# EAGLE design oledm204 (EAGLE 9.6.2)
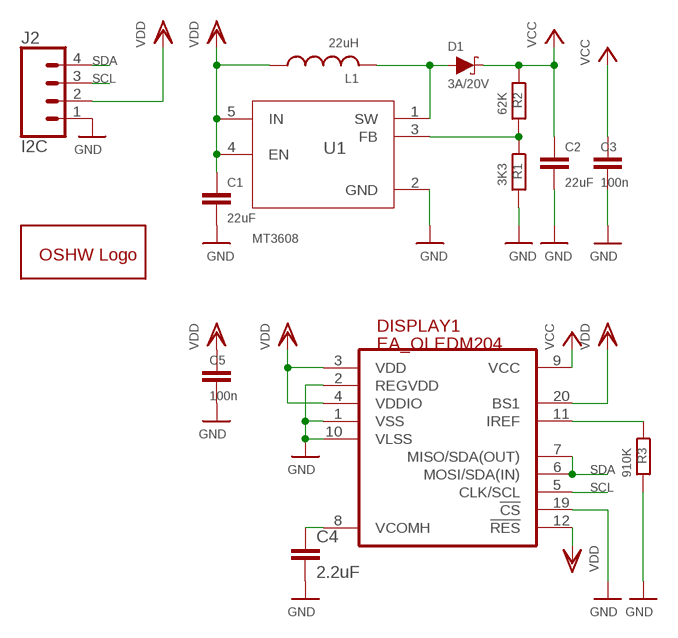
[diagram p0: schematic, sheet 1]

## Parts
C1  22uF  C-EUC0603  [C0603]
C2  22uF  C-EUC0603  [C0603]
C3  100n  C-EUC0603  [C0603]
C4  2.2uF  C-EUC0603  [C0603]
C5  100n  C-EUC0603  [C0603]
D1  3A/20V  DIODE-SCHOTTKY-SS14  [SMA-DIODE]
DISPLAY1  EA_OLEDM204  [EA_OLEDM204]
GOLD_ORB_SM1  OSHWLOGOLOGO5MM  [OSHW_5MM]
J2  I2C  CONN_04  [1X04]
L1  22uH  L-USPIS2816  [PIS2816]
R1  3K3  R-EU_R0402  [R0402]
R2  62K  R-EU_R0402  [R0402]
R3  910K  R-EU_R0402  [R0402]
U1  MT3608  [SOT95P280X145-6N]

## Nets
GND: C1.2 C2.2 C3.2 C4.2 C5.2 DISPLAY1.1(VSS) DISPLAY1.2(REGVDD) DISPLAY1.10(VLSS) DISPLAY1.19(!CS!) J2.1 R1.2 R3.2 U1.2(GND)
N$1: DISPLAY1.11(IREF) R3.1
N$3: R1.1 R2.2 U1.3(FB)
N$4: D1.A L1.2 U1.1(SW)
N$5: C4.1 DISPLAY1.8(VCOMH)
SCL: DISPLAY1.5(CLK/SCL) J2.3
SDA: DISPLAY1.6(MOSI/SDA(IN)) DISPLAY1.7(MISO/SDA(OUT)) J2.4
VCC: C2.1 C3.1 D1.C DISPLAY1.9(VCC) R2.1
VDD: C1.1 C5.1 DISPLAY1.3(VDD) DISPLAY1.4(VDDIO) DISPLAY1.12(!RES!) DISPLAY1.20(BS1) J2.2 L1.1 U1.4(EN) U1.5(IN)

## Library data of the parts
C1-C5 = rcl:C-EU: CAPACITOR, European symbol; SPICEPREFIX: C
D1 = SparkFun-DiscreteSemi:DIODE-SCHOTTKY: Schottky diode A Schottky diode is a semiconductor diode which has a low forward voltage drop and a very fast switching action.; PROD_ID: DIO-08053; VALUE: 1A/40V/500mV
DISPLAY1 = ea_v65:EA_OLEDM204: ELECTRONIC ASSEMBLY EA OLEDM204-LGA EA OLEDM204-LWA EA OLEDM204-GGA
GOLD_ORB_SM1 = oshw:OSHWLOGO: The OSHW logo for PCB layout
J2 = SparkFun-Connectors:CONN_04: Multi connection point. Often used as Generic Header-pin footprint for 0.1 inch spaced/style header connections On any of the 0.1 inch spaced packages, you can populate with these: Break Away Headers - Straight <https://www.sparkfun.com/products/116> (PRT-00116) Break Away Male Headers - Right Angle <https://www.sparkfun.com/products/553> (PRT-00553) Female Headers <https://www.sparkfun.com/products/115> (PRT-00115) Break Away Headers - Machine Pin <https://www.sparkfun.com/products/117> (PRT-00117) Break Away Female Headers - Swiss Machine Pin <https://www.sparkfun.com/products/743> (PRT-00743) For SCREWTERMINALS and SPRING TERMINALS visit here: Screw Terimnals on SparkFun.com <https://www.sparkfun.com/search/results?term=Screw+Terminals> (5mm/3.5mm/2.54mm spacing) This device is also useful as a general connection point to wire up your design to another part of your project. Our various solder wires solder well into these plated through hole pads. Hook-Up Wire - Assortment (Stranded, 22 AWG) <https://www.sparkfun.com/products/11375> (PRT-11375) Hook-Up Wire - Assortment (Solid Core, 22 AWG) <https://www.sparkfun.com/products/11367> (PRT-11367) View the entire wire category on our website here <https://www.sparkfun.com/categories/141> Special notes: Molex polarized connector foot print use with SKU : PRT-08231 with associated crimp pins and housings. 1MM SMD Version SKU: PRT-10208; PROD_ID: CONN-09696
L1 = rcl:L-US: INDUCTOR, American symbol; SPICEPREFIX: L
R1-R3 = resistor:R-EU_: RESISTOR, European symbol
U1 = MT3608:MT3608: High Efficiency 1.2MHz 2A Step Up Converter; AVAILABILITY: Unavailable; DESCRIPTION: High Efficiency 1.2MHz 2A Step Up Converter; MF: Aerosemi Technology Co., Ltd; MP: MT3608; PACKAGE: Package; PRICE: None

## Board
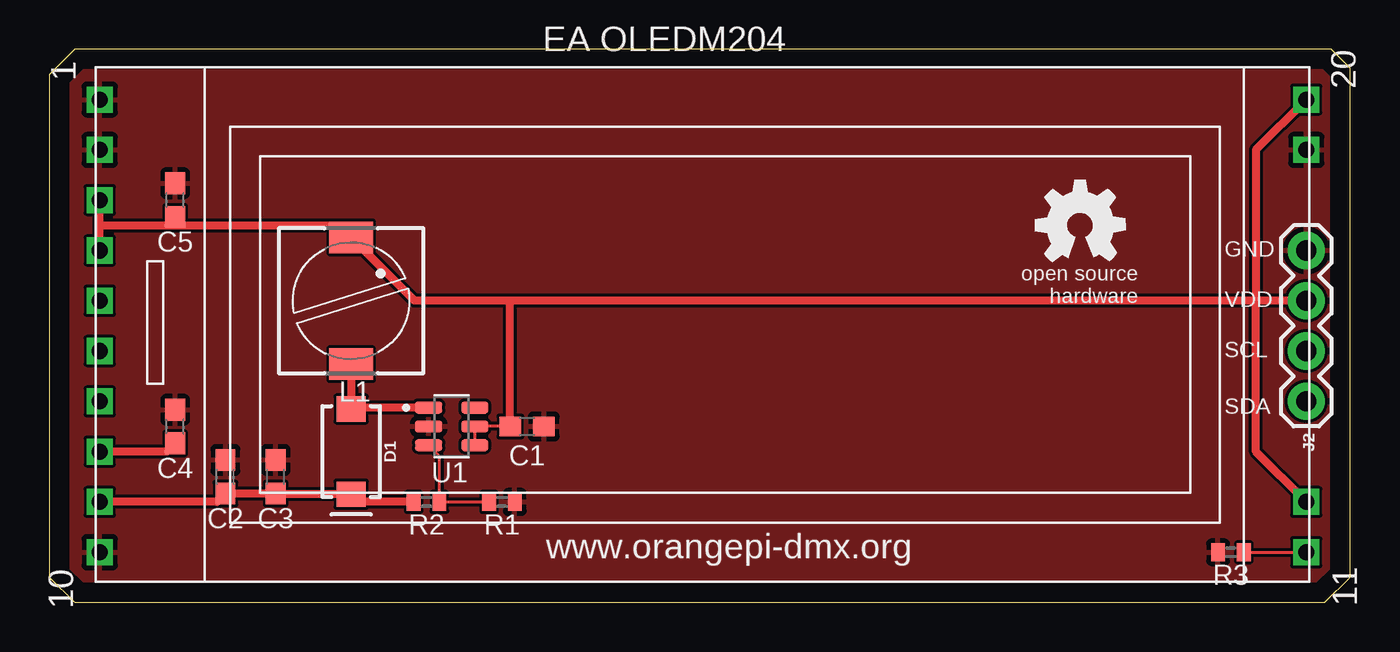
[diagram p1: board, top side]
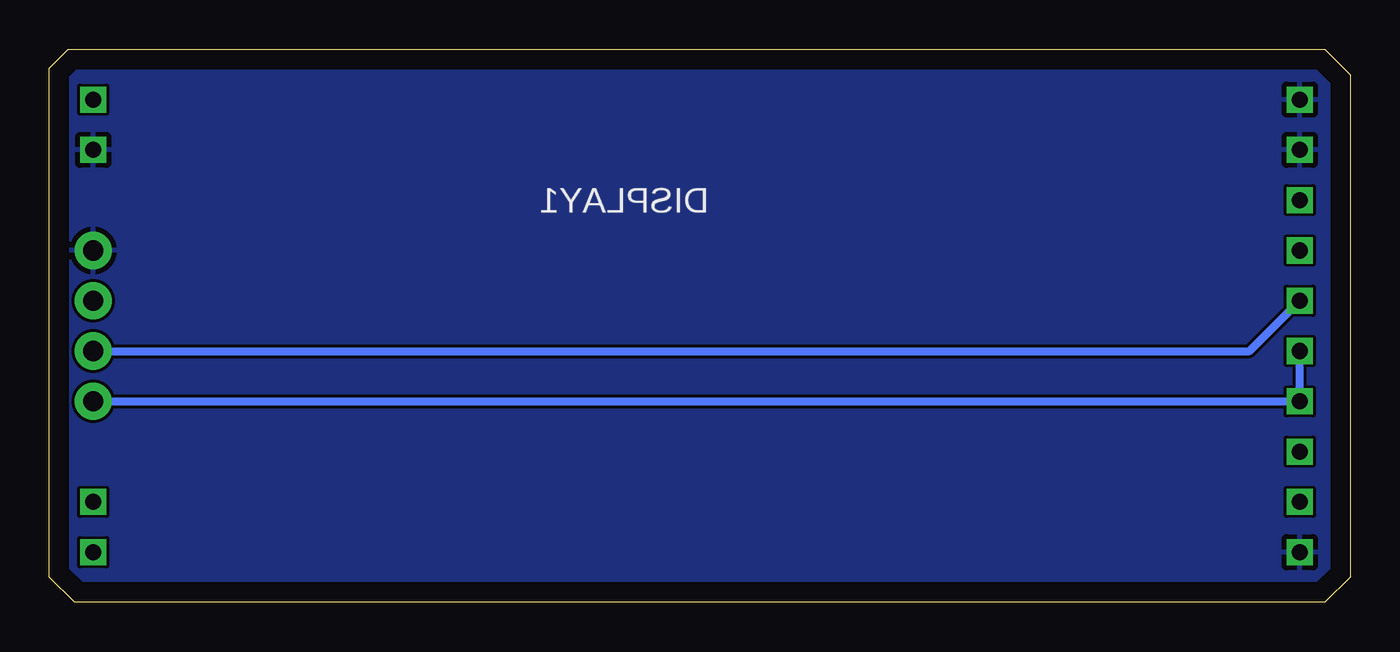
[diagram p2: board, bottom side, seen from below]

Size 65.71 x 27.93 mm. Coordinates in mm from the lower left corner, seen from the top.
Outline: 0,26.66 0,1.27 1.27,0 64.44,0 65.71,1.27 65.71,26.99 64.77,27.93 1.27,27.93 0,26.66
Copper layers (1*16): Top 0.035mm / dielectric 1.5mm / Bottom 0.035mm
Design rules "default": minimum track width 6mil, minimum drill 0.35mm, track to track 6mil, track to pad 6mil, pad to pad 6mil, via to via 6mil, smd to smd 6mil, copper to edge 40mil, drill to drill 6mil, minimum pad ring 10mil, minimum via ring 8mil, stop-mask expansion 4mil, vias tented up to drill 0mil, thermal gap 10mil

### Footprints (pad centres in the part's own frame; a part is rotated, then mirrored left to right if it is on the bottom)
C0603 = smd 1.1 x 1: 1 -0.85,0; 2 0.85,0
SMA-DIODE = smd 1.27 x 1.47: A -2.15,0; C 2.15,0
EA_OLEDM204 = drill 0.813 square: 1 0,22.86; 2 0,20.32; 3 0,17.78; 4 0,15.24; 5 0,12.7; 6 0,10.16; 7 0,7.62; 8 0,5.08; 9 0,2.54; 10 0,0; 11 60.96,0; 12 60.96,2.54; 19 60.96,20.32; 20 60.96,22.86
1X04 = drill 1.016 pad 1.88: 1 0,0; 2 2.54,0; 3 5.08,0; 4 7.62,0
PIS2816 = smd 2.2 x 1.6: 1 0,3.2; 2 0,-3.2
R0402 = smd 0.7 x 0.9: 1 -0.65,0; 2 0.65,0
SOT95P280X145-6N = smd 1.37 x 0.59: 1 -1.17,0.95; 2 -1.17,0; 3 -1.17,-0.95; 4 1.17,-0.95; 5 1.17,0; 6 1.17,0.95

### Placement (x,y rotation side)
C1  24.13,8.89 0 top
C2  8.89,6.35 90 top
C3  11.43,6.35 90 top
C4  6.35,8.89 90 top
C5  6.35,20.32 90 top
D1  15.24,7.62 270 top
DISPLAY1  2.54,2.54 0 top
GOLD_ORB_SM1  52.07,19.05 0 top
J2  63.5,17.78 270 top
L1  15.24,15.24 0 top
R1  22.86,5.08 0 top
R2  19.05,5.08 0 top
R3  59.69,2.54 180 top
U1  20.32,8.89 0 top

### Tracks (layer width: path | path; a pad name or v marks a point on that pad's centre or on a via)
GND
  pour Top: -1.27,-1.27 67.31,-1.27 67.31,29.21 -1.27,29.21
  pour Bottom: -1.27,-1.27 67.31,-1.27 67.31,29.21 -1.27,29.21
N$1
  Top 0.152: R3.1 DISPLAY1.11
N$3
  Top 0.152: R1.1 R2.2 19.7,7.39 U1.3
N$4
  Top 0.152: 15.31,9.84 D1.A
  Top 0.406: U1.1 15.31,9.84 | L1.2 D1.A
N$5
  Top 0.406: C4.1 5.93,7.62 DISPLAY1.8
SCL
  Bottom 0.406: J2.3 5.08,12.7 DISPLAY1.5
SDA
  Bottom 0.406: J2.4 DISPLAY1.7 DISPLAY1.6
VCC
  Top 0.152: 15.44,5.27 D1.C
  Top 0.406: R2.1 15.63,5.08 15.44,5.27 | D1.C 11.46,5.47 C3.1 C2.1 8.47,5.08 DISPLAY1.9
VDD
  Top 0.152: C1.1 U1.5 U1.4
  Top 0.406: DISPLAY1.12 60.96,7.62 60.96,15.24 | DISPLAY1.20 60.96,22.86 60.96,15.24 | J2.2 60.96,15.24 | 60.96,15.24 23.18,15.24 | 23.18,15.24 18.44,15.24 L1.1 14.63,19.05 6.35,19.05 | C1.1 23.28,15.14 23.18,15.24 | DISPLAY1.4 2.54,19.05 | 2.54,19.05 DISPLAY1.3 | 2.54,19.05 6.35,19.05 | C5.1 6.35,19.05

### Text on the board
tNames: GND | VDD | SCL | SDA | www.orangepi-dmx.org